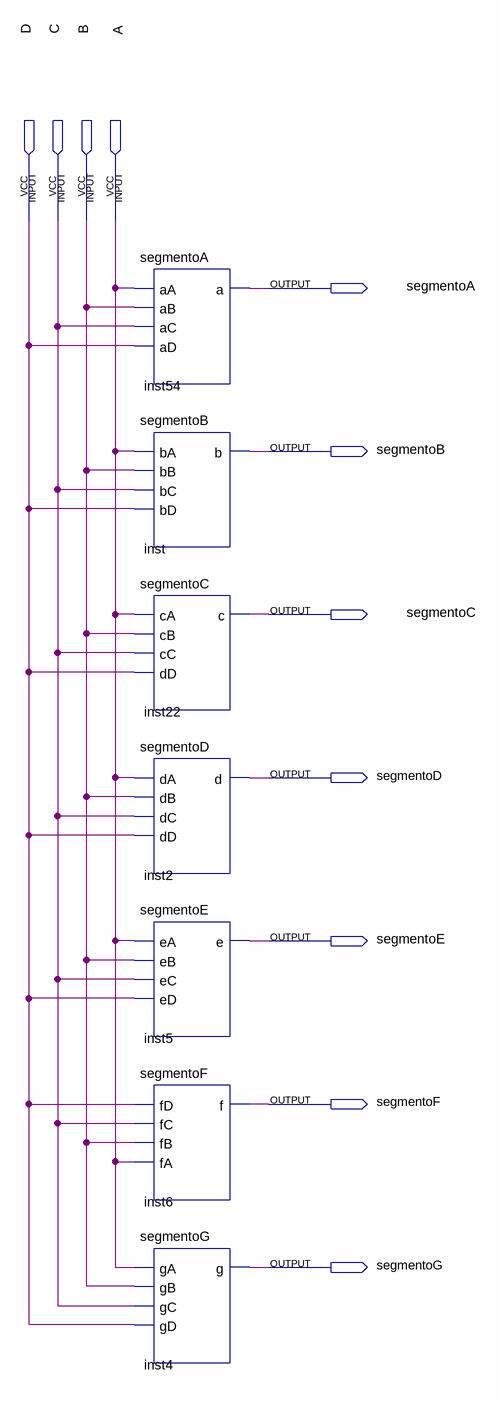
[diagram p0: schematic sheet]
// Quartus schematic decodificadorBinarioHexadecimal.bdf as structural Verilog: 7 symbols, 11 pins
module decodificadorBinarioHexadecimal (
  input  D,
  input  C,
  input  B,
  input  A,
  output segmentoA,
  output segmentoB,
  output segmentoC,
  output segmentoD,
  output segmentoE,
  output segmentoF,
  output segmentoG
);

  segmentoA inst54 (.aA(A), .aB(B), .aC(C), .aD(D), .a(segmentoA));
  segmentoB inst (.bA(A), .bB(B), .bC(C), .bD(D), .b(segmentoB));
  segmentoC inst22 (.cA(A), .cB(B), .cC(C), .dD(D), .c(segmentoC));
  segmentoD inst2 (.dA(A), .dB(B), .dC(C), .dD(D), .d(segmentoD));
  segmentoE inst5 (.eA(A), .eB(B), .eC(C), .eD(D), .e(segmentoE));
  segmentoF inst6 (.fD(D), .fC(C), .fB(B), .fA(A), .f(segmentoF));
  segmentoG inst4 (.gA(A), .gB(B), .gC(C), .gD(D), .g(segmentoG));
endmodule
